# Altium project microphone_array.PrjPcb
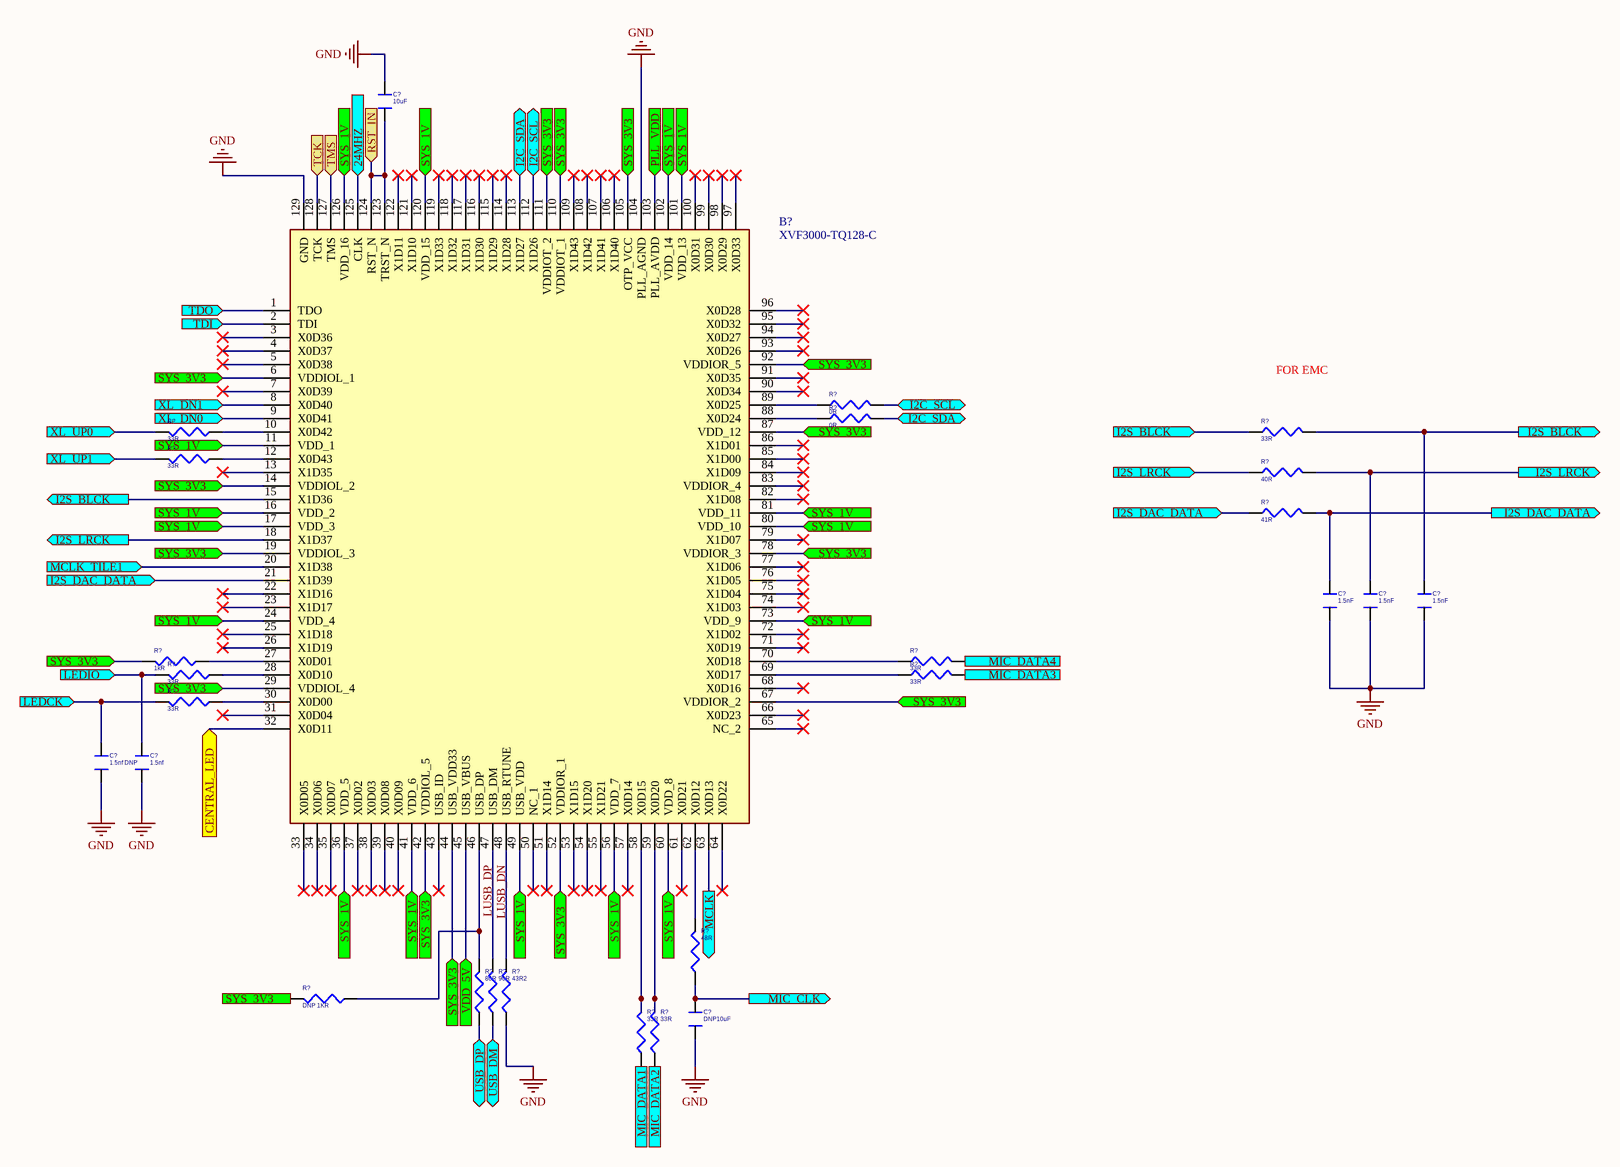
[diagram p0: XVF3000.SchDoc]
7 sheets, 228 parts. Net scope: flat (ports and power ports of the same name join across sheets).
Sheets:
  XVF3000.SchDoc
  WM8960.SchDoc
  Power_interconnect.SchDoc
  Microphone.SchDoc
  led.SchDoc
  Sys_Clock.SchDoc
  X_core_Powerful_pull_up.SchDoc

## Sheet XVF3000.SchDoc
size A3; SheetNumber: 1; SheetTotal: 7

### Parts
(Parts that share a designator on the sheet are numbered #1, #2 ... from top to bottom, then left to right.)
B?#1  XVF3000-TQ128-C  [QFP40P1600X1600X120-129N]
C?#1  10uF  [C0603]
C?#2  1.5nF  [C0603]
C?#3  1.5nF  [C0603]
C?#4  1.5nF  [C0603]
C?#5  1.5nf DNP  [C0603]
C?#6  1.5nf  [C0603]
C?#7  DNP10uF  [C0603]
R?#1  33R  [R 0603]
R?#2  0R  [R 0603]
R?#3  0R  [R 0603]
R?#4  33R  [R 0603]
R?#5  33R  [R 0603]
R?#6  40R  [R 0603]
R?#7  41R  [R 0603]
R?#8  1kR  [R 0603]
R?#9  33R  [R 0603]
R?#10  33R  [R 0603]
R?#11  33R  [R 0603]
R?#12  33R  [R 0603]
R?#13  48R  [R 0603]
R?#14  DNP 1KR  [R 0603]
R?#15  80R  [R 0603]
R?#16  90R  [R 0603]
R?#17  43R2  [R 0603]
R?#18  33R  [R 0603]
R?#19  33R  [R 0603]

### Ports
24MHZ (in), _I2S_BLCK (out), _I2S_DAC_DATA (out), _I2S_LRCK (out), CENTRAL_LED (in), I2C_SCL (bidir), I2C_SDA (bidir), I2S_BLCK (in), I2S_BLCK (out), I2S_DAC_DATA (in), I2S_LRCK (in), I2S_LRCK (out), LEDCK (in), LEDIO (in), MCLK (out), MCLK_TILE1 (in), MIC_CLK (out), MIC_DATA1 (in), MIC_DATA2 (in), MIC_DATA3 (in), MIC_DATA4 (in), PLL_VDD (in), RST_IN (in), SYS_1V (in), SYS_3V3 (in), TCK (in), TDI (in), TDO (in), TMS (in), USB_DM (bidir), USB_DP (bidir), VDD_5V (in), XL_DN0 (in), XL_DN1 (in), XL_UP0 (in), XL_UP1 (in)

### Nets
GND: B?#1.104(PLL_AGND) B?#1.129(GND) C?#1.2 C?#2.1 C?#3.1 C?#4.1 C?#5.1 C?#6.1 C?#7.1 R?#17.1
LUSB_DN: B?#1.47(USB_DM) R?#16.2
LUSB_DP: B?#1.46(USB_DP) R?#14.1 R?#15.2
NetB?#1_1: B?#1.1(TDO) ; port TDO
NetB?#1_2: B?#1.2(TDI) ; port TDI
NetB?#1_6: B?#1.6(VDDIOL_1) B?#1.14(VDDIOL_2) B?#1.19(VDDIOL_3) B?#1.29(VDDIOL_4) B?#1.42(VDDIOL_5) B?#1.44(USB_VDD33) B?#1.52(VDDIOR_1) B?#1.67(VDDIOR_2) B?#1.78(VDDIOR_3) B?#1.87(VDD_12) B?#1.92(VDDIOR_5) B?#1.105(OTP_VCC) B?#1.110(VDDIOT_1) B?#1.111(VDDIOT_2) R?#8.2 R?#14.2 ; port SYS_3V3
NetB?#1_8: B?#1.8(X0D40) ; port XL_DN1
NetB?#1_9: B?#1.9(X0D41) ; port XL_DN0
NetB?#1_10: B?#1.10(X0D42) R?#1.1
NetB?#1_11: B?#1.11(VDD_1) B?#1.16(VDD_2) B?#1.17(VDD_3) B?#1.24(VDD_4) B?#1.36(VDD_5) B?#1.41(VDD_6) B?#1.49(USB_VDD) B?#1.56(VDD_7) B?#1.60(VDD_8) B?#1.73(VDD_9) B?#1.80(VDD_10) B?#1.81(VDD_11) B?#1.101(VDD_13) B?#1.102(VDD_14) B?#1.120(VDD_15) B?#1.126(VDD_16) ; port SYS_1V
NetB?#1_12: B?#1.12(X0D43) R?#4.1
NetB?#1_15: B?#1.15(X1D36) R?#5.1 ; port I2S_BLCK
NetB?#1_18: B?#1.18(X1D37) R?#6.1 ; port I2S_LRCK
NetB?#1_20: B?#1.20(X1D38) ; port MCLK_TILE1
NetB?#1_21: B?#1.21(X1D39) R?#7.1 ; port I2S_DAC_DATA
NetB?#1_27: B?#1.27(X0D01) R?#8.1
NetB?#1_28: B?#1.28(X0D10) R?#9.1
NetB?#1_30: B?#1.30(X0D00) R?#11.1
NetB?#1_32: B?#1.32(X0D11) ; port CENTRAL_LED
NetB?#1_45: B?#1.45(USB_VBUS) ; port VDD_5V
NetB?#1_48: B?#1.48(USB_RTUNE) R?#17.2
NetB?#1_58: B?#1.58(X0D15) R?#18.2
NetB?#1_59: B?#1.59(X0D20) R?#19.2
NetB?#1_62: B?#1.62(X0D12) R?#13.2
NetB?#1_63: B?#1.63(X0D13) ; port MCLK
NetB?#1_69: B?#1.69(X0D17) R?#12.1
NetB?#1_70: B?#1.70(X0D18) R?#10.1
NetB?#1_88: B?#1.88(X0D24) R?#3.1
NetB?#1_89: B?#1.89(X0D25) R?#2.1
NetB?#1_103: B?#1.103(PLL_AVDD) ; port PLL_VDD
NetB?#1_112: B?#1.112(X1D26) R?#2.2 ; port I2C_SCL
NetB?#1_113: B?#1.113(X1D27) R?#3.2 ; port I2C_SDA
NetB?#1_123: B?#1.123(TRST_N) B?#1.124(RST_N) C?#1.1 ; port RST_IN
NetB?#1_125: B?#1.125(CLK) ; port 24MHZ
NetB?#1_127: B?#1.127(TMS) ; port TMS
NetB?#1_128: B?#1.128(TCK) ; port TCK
NetB?#3_12: C?#4.2 R?#5.2 ; port _I2S_BLCK
NetB?#3_13: C?#3.2 R?#6.2 ; port _I2S_LRCK
NetB?#3_14: C?#2.2 R?#7.2 ; port _I2S_DAC_DATA
NetB?#6_2: C?#6.2 R?#9.2 ; port LEDIO
NetB?#7_2: C?#5.2 R?#11.2 ; port LEDCK
NetB?#8_1: C?#7.2 R?#13.1 ; port MIC_CLK
NetJ?#2_15: R?#15.1 ; port USB_DP
NetJ?#2_16: R?#16.1 ; port USB_DM
NetMK?#1_4: R?#19.1 ; port MIC_DATA2
NetMK?#2_4: R?#10.2 ; port MIC_DATA4
NetMK?#3_4: R?#12.2 ; port MIC_DATA3
NetMK_4: R?#18.1 ; port MIC_DATA1
NetR?#1_2: R?#1.2 ; port XL_UP0
NetR?#4_2: R?#4.2 ; port XL_UP1

Not connected (* = marked no-connect by the designer): B?#1 3(X0D36)* 4(X0D37)* 5(X0D38)* 7(X0D39)* 13(X1D35)* 22(X1D16)* 23(X1D17)* 25(X1D18)* 26(X1D19)* 31(X0D04)* 33(X0D05)* 34(X0D06)* 35(X0D07)* 37(X0D02)* 38(X0D03)* 39(X0D08)* 40(X0D09)* 43(USB_ID)* 50(NC_1)* 51(X1D14)* 53(X1D15)* 54(X1D20)* 55(X1D21)* 57(X0D14)* 61(X0D21)* 64(X0D22)* 65(NC_2)* 66(X0D23)* 68(X0D16)* 71(X0D19)* 72(X1D02)* 74(X1D03)* 75(X1D04)* 76(X1D05)* 77(X1D06)* 79(X1D07)* 82(X1D08)* 83(VDDIOR_4)* 84(X1D09)* 85(X1D00)* 86(X1D01)* 90(X0D34)* 91(X0D35)* 93(X0D26)* 94(X0D27)* 95(X0D32)* 96(X0D28)* 97(X0D33)* 98(X0D29)* 99(X0D30)* 100(X0D31)* 106(X1D40)* 107(X1D41)* 108(X1D42)* 109(X1D43)* 114(X1D28)* 115(X1D29)* 116(X1D30)* 117(X1D31)* 118(X1D32)* 119(X1D33)* 121(X1D10)* 122(X1D11)*

### Notes on the sheet
- FOR EMC

### Library data of the parts
B?#1 = XVF3000-TQ128-C: IC PROC 32BIT VOICE XCORE TQ128; Manufacturer_Name: XMOS; Geometry.Height: 1.2mm; Manufacturer_Part_Number: XVF3000-TQ128-C; Mouser Part Number: *; Mouser Price/Stock: *; Arrow Part Number: *; Arrow Price/Stock: *; Datasheet Link: https://datasheet.datasheetarchive.com/originals/distributors/DKDS-37/730530.pdf
C?#1-C?#7 = CAPACITOR_0_Dup5_3: CAP ±20%/10V/X5R/SMT0603; PAGE: 2
R?#1-R?#19 = R_Dup1: RES 1/16W 5% SMT0402

## Sheet WM8960.SchDoc
size A3; SheetNumber: 2; SheetTotal: 6
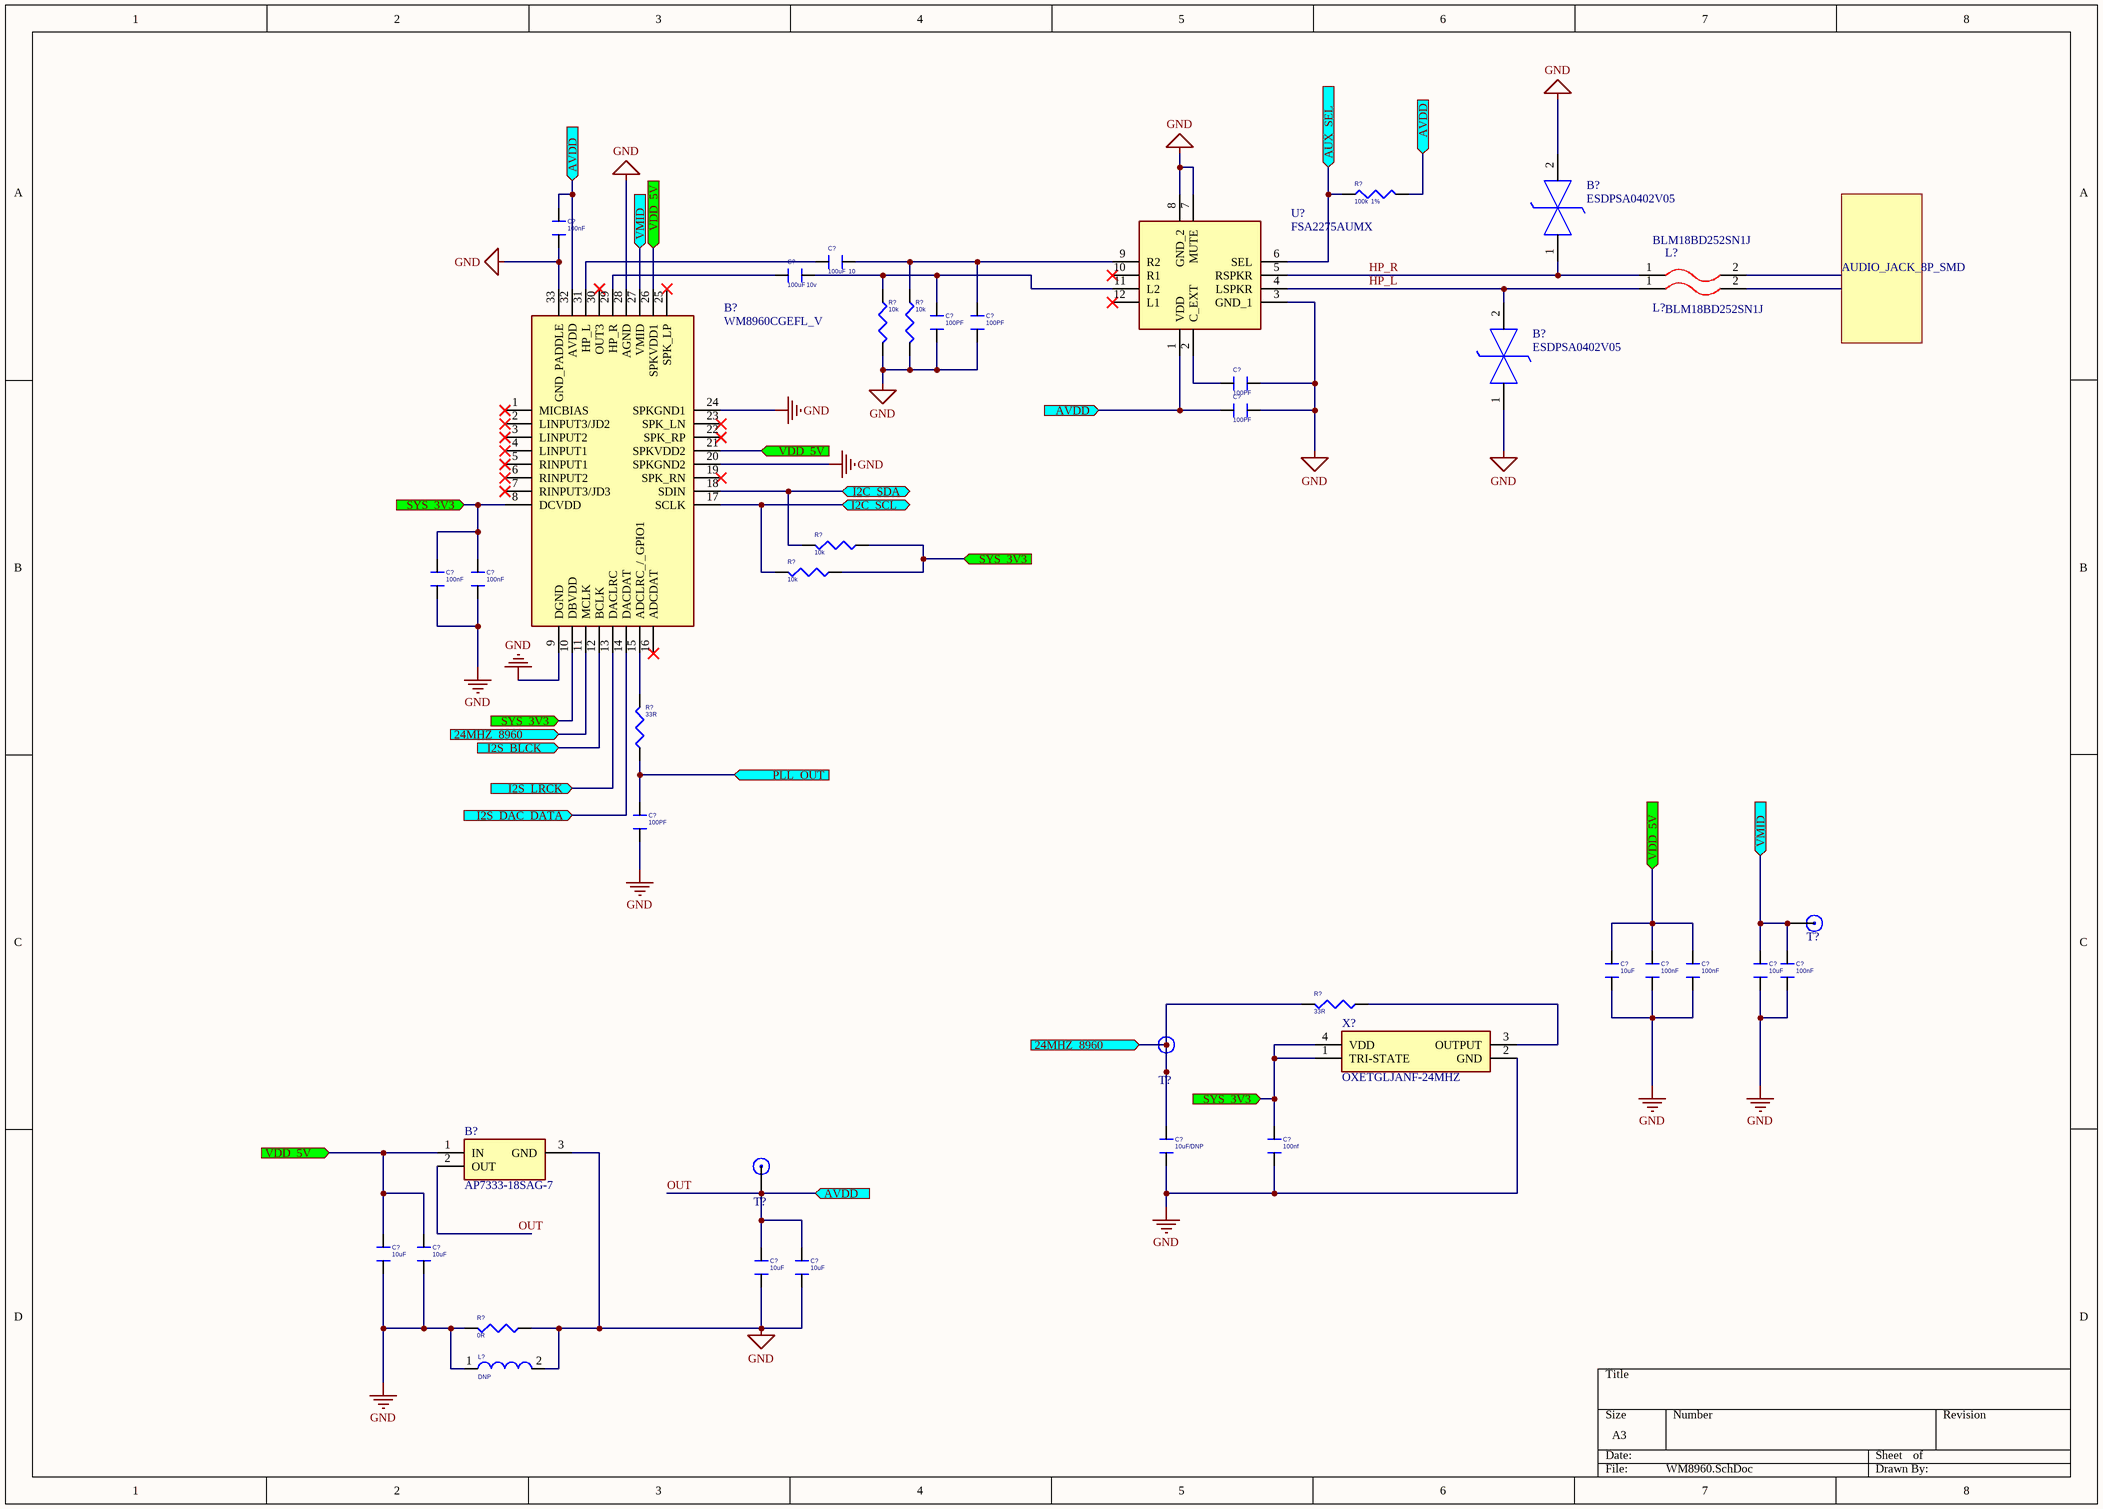
[diagram p1: WM8960.SchDoc]

### Parts
(Parts that share a designator on the sheet are numbered #1, #2 ... from top to bottom, then left to right.)
B?#2  ESDPSA0402V05  [ESDPSA0402V05]
B?#3  WM8960CGEFL_V  [QFN50P500X500X100-33N]
B?#4  ESDPSA0402V05  [ESDPSA0402V05]
B?#5  AP7333-18SAG-7  [SOT96P240X135-3N]
C?#8  100nF  [C0603]
C?#9  100uF  10  [C0603]
C?#10  100uF 10v  [C0603]
C?#11  100PF  [C0603]
C?#12  100PF  [C0603]
C?#13  100PF  [C0603]
C?#14  100PF  [C0603]
C?#15  100nF  [C0603]
C?#16  100nF  [C0603]
C?#17  100PF  [C0603]
C?#18  10uF  [C0603]
C?#19  100nF  [C0603]
C?#20  100nF  [C0603]
C?#21  10uF  [C0603]
C?#22  100nF  [C0603]
C?#23  10uF/DNP  [C0603]
C?#24  100nf  [C0603]
C?#25  10uF  [C0603]
C?#26  10uF  [C0603]
C?#27  10uF  [C0603]
C?#28  10uF  [C0603]
L?#1  BLM18BD252SN1J  [BLM18EG121SH1D]
L?#2  BLM18BD252SN1J  [BLM18EG121SH1D]
L?#3  DNP  [CD35]
R?#20  100k  1%  [R 0603]
R?#21  10k  [R 0603]
R?#22  10k  [R 0603]
R?#23  10k  [R 0603]
R?#24  10k  [R 0603]
R?#25  33R  [R 0603]
R?#26  33R  [R 0603]
R?#27  0R  [R 0603]
T?#1  Test_point  [Test_point]  (value not drawn)
T?#2  Test_point  [Test_point]  (value not drawn)
T?#3  Test_point  [Test_point]  (value not drawn)
U?#1  FSA2275AUMX  [FSA2275AUMX]
X?#1  OXETGLJANF-24MHZ  [OXETGLJANF24MHZ]

### Ports
24MHZ_8960 (in), _I2S_BLCK (in), _I2S_DAC_DATA (in), _I2S_LRCK (in), AUX_SEL (in), AVDD (in), I2C_SCL (bidir), I2C_SDA (bidir), PLL_OUT (in), SYS_3V3 (in), VDD_5V (in), VMID (in)

### Nets
GND: B?#2.2(K2) B?#3.9(DGND) B?#3.20(SPKGND2) B?#3.24(SPKGND1) B?#3.28(AGND) B?#3.33(GND_PADDLE) B?#4.1(K1) B?#5.3(GND) C?#8.1 C?#11.1 C?#12.1 C?#13.1 C?#14.1 C?#15.1 C?#16.1 C?#17.1 C?#18.1 C?#19.1 C?#20.1 C?#21.1 C?#22.1 C?#23.1 C?#24.1 C?#25.1 C?#26.1 C?#27.1 C?#28.1 L?#3.1 L?#3.2 R?#21.2 R?#22.2 R?#27.1 R?#27.2 U?#1.3(GND_1) U?#1.7(MUTE) U?#1.8(GND_2) X?#1.2(GND)
HP_L: B?#4.2(K2) L?#2.1 U?#1.4(LSPKR)
HP_R: B?#2.1(K1) L?#1.1 U?#1.5(RSPKR)
OUT: B?#3.32(AVDD) B?#5.2(OUT) C?#8.2 C?#14.2 C?#27.2 C?#28.2 R?#20.2 T?#3.1 U?#1.1(VDD) ; port AVDD
NetB?#1_6: B?#3.8(DCVDD) B?#3.10(DBVDD) C?#15.2 C?#16.2 C?#24.2 R?#23.1 R?#24.1 X?#1.1(TRI-STATE) X?#1.4(VDD) ; port SYS_3V3
NetB?#1_45: B?#3.21(SPKVDD2) B?#3.26(SPKVDD1) B?#5.1(IN) C?#18.2 C?#19.2 C?#20.2 C?#25.2 C?#26.2 ; port VDD_5V
NetB?#1_112: B?#3.17(SCLK) R?#24.2 ; port I2C_SCL
NetB?#1_113: B?#3.18(SDIN) R?#23.2 ; port I2C_SDA
NetB?#3_11: B?#3.11(MCLK) C?#23.2 R?#26.2 T?#2.1 ; port 24MHZ_8960
NetB?#3_12: B?#3.12(BCLK) ; port _I2S_BLCK
NetB?#3_13: B?#3.13(DACLRC) ; port _I2S_LRCK
NetB?#3_14: B?#3.14(DACDAT) ; port _I2S_DAC_DATA
NetB?#3_15: B?#3.15(ADCLRC_/_GPIO1) R?#25.2
NetB?#3_27: B?#3.27(VMID) C?#21.2 C?#22.2 T?#1.1 ; port VMID
NetB?#3_29: B?#3.29(HP_R) C?#10.2
NetB?#3_31: B?#3.31(HP_L) C?#9.2
NetC?#9_1: C?#9.1 C?#12.2 R?#22.1 U?#1.9(R2)
NetC?#10_1: C?#10.1 C?#11.2 R?#21.1 U?#1.11(L2)
NetC?#13_2: C?#13.2 U?#1.2(C_EXT)
NetC?#17_2: C?#17.2 R?#25.1 ; port PLL_OUT
NetJ?#1_1: R?#20.1 U?#1.6(SEL) ; port AUX_SEL
NetR?#26_1: R?#26.1 X?#1.3(OUTPUT)

Not connected (* = marked no-connect by the designer): B?#3 1(MICBIAS)* 2(LINPUT3/JD2)* 3(LINPUT2)* 4(LINPUT1)* 5(RINPUT1)* 6(RINPUT2)* 7(RINPUT3/JD3)* 16(ADCDAT)* 19(SPK_RN)* 22(SPK_RP)* 23(SPK_LN)* 25(SPK_LP)* 30(OUT3)*; L?#1 2; L?#2 2; U?#1 10(R1)* 12(L1)*

### Notes on the sheet
- AUDIO_JACK_8P_SMD

### Library data of the parts
B?#2 B?#4 = ESDPSA0402V05: Polymer ESD Suppressor; Manufacturer_Name: Good-Ark; Geometry.Height: 0.45mm; Manufacturer_Part_Number: ESDPSA0402V05; Mouser Part Number: *; Mouser Price/Stock: *; Arrow Part Number: *; Arrow Price/Stock: *; Datasheet Link: https://4donline.ihs.com/images/VipMasterIC/IC/GOAE/GOAE-S-A0000149384/GOAE-S-A0000149384-1.pdf?hkey=EF798316E3902B6ED9A73243A3159BB0
B?#3 = WM8960CGEFL_V: Interface - CODECs Stereo CODEC with 1W DRIVER; Manufacturer_Name: Cirrus Logic; Manufacturer_Part_Number: WM8960CGEFL/V; Geometry.Height: 1mm; Mouser Part Number: 238-WM8960CGEFL/V; Mouser Price/Stock: https://www.mouser.co.uk/ProductDetail/Cirrus-Logic/WM8960CGEFL-V?qs=G8wrXCBxhFteielmzwPrEw%3D%3D; Arrow Part Number: *; Arrow Price/Stock: *; Datasheet Link: https://componentsearchengine.com/Datasheets/1/WM8960CGEFL_V.pdf
B?#5 = AP7333-18SAG-7: Diodes Inc AP7333-18SAG-7, Single Linear Voltage Regulator, 300mA 1.8 V, +/-2%, 3-Pin SOT-23; Manufacturer_Name: Diodes Inc.; Geometry.Height: 1.35mm; Manufacturer_Part_Number: AP7333-18SAG-7; Mouser Part Number: 621-AP7333-18SAG-7; Mouser Price/Stock: https://www.mouser.co.uk/ProductDetail/Diodes-Incorporated/AP7333-18SAG-7?qs=vIZ3oKQCLxpEALu0NaomtQ%3D%3D; Arrow Part Number: AP7333-18SAG-7; Arrow Price/Stock: https://www.arrow.com/en/products/ap7333-18sag-7/diodes-incorporated?region=nac; Datasheet Link: https://www.diodes.com/assets/Datasheets/AP7333.pdf
C?#8-C?#28 = CAPACITOR_0_Dup3: CAP ±20%/10V/X5R/SMT0603; PAGE: 1
L?#1 L?#2 = BLM18BD252SN1J: BLM18_N1J Series EMI Suppression Filter 2500+/-25% at 100MHz 150mA @85; Manufacturer_Name: Murata Electronics; Geometry.Height: 0.95mm; Manufacturer_Part_Number: BLM18BD252SN1J; Mouser Part Number: *; Mouser Price/Stock: *; Arrow Part Number: *; Arrow Price/Stock: *; Datasheet Link: http://www.murata.com/~/media/webrenewal/support/library/catalog/products/emc/emifil/c31e.ashx?la=en-gb
L?#3 = INDUCTOR_1: Inductor 2000MA 4.0X4.0X2.0
R?#20-R?#27 = R_Dup1: RES 1/16W 5% SMT0402
U?#1 = FSA2275AUMX: ON Semiconductor FSA2275AUMX, Audio Switch IC DPDT, 3.3 V dc, 12-Pin UMLP; Manufacturer_Name: onsemi; Geometry.Height: 0.6mm; Manufacturer_Part_Number: FSA2275AUMX; Mouser Part Number: 512-FSA2275AUMX; Mouser Price/Stock: https://www.mouser.co.uk/ProductDetail/ON-Semiconductor-Fairchild/FSA2275AUMX?qs=Mv7BduZupUhxHdQdUdEuNg%3D%3D; Arrow Part Number: FSA2275AUMX; Arrow Price/Stock: https://www.arrow.com/en/products/fsa2275aumx/on-semiconductor; Datasheet Link: https://www.onsemi.com/pub/Collateral/FSA2275A-D.pdf
X?#1 = OXETGLJANF-24MHZ: 3.3V~3.3V -40~+85 15mA +/-50ppm 24MHz SMD3225-4P Oscillators ROHS; Manufacturer_Name: TAITIEN; Geometry.Height: 1.1mm; Manufacturer_Part_Number: OXETGLJANF-24MHZ; Mouser Part Number: *; Mouser Price/Stock: *; Arrow Part Number: *; Arrow Price/Stock: *; Datasheet Link: https://datasheet.lcsc.com/lcsc/1811052217_TAITIEN-Elec-OXETGLJANF-24MHZ_C295524.pdf

## Sheet Power_interconnect.SchDoc
size A3; SheetNumber: 3; SheetTotal: 6
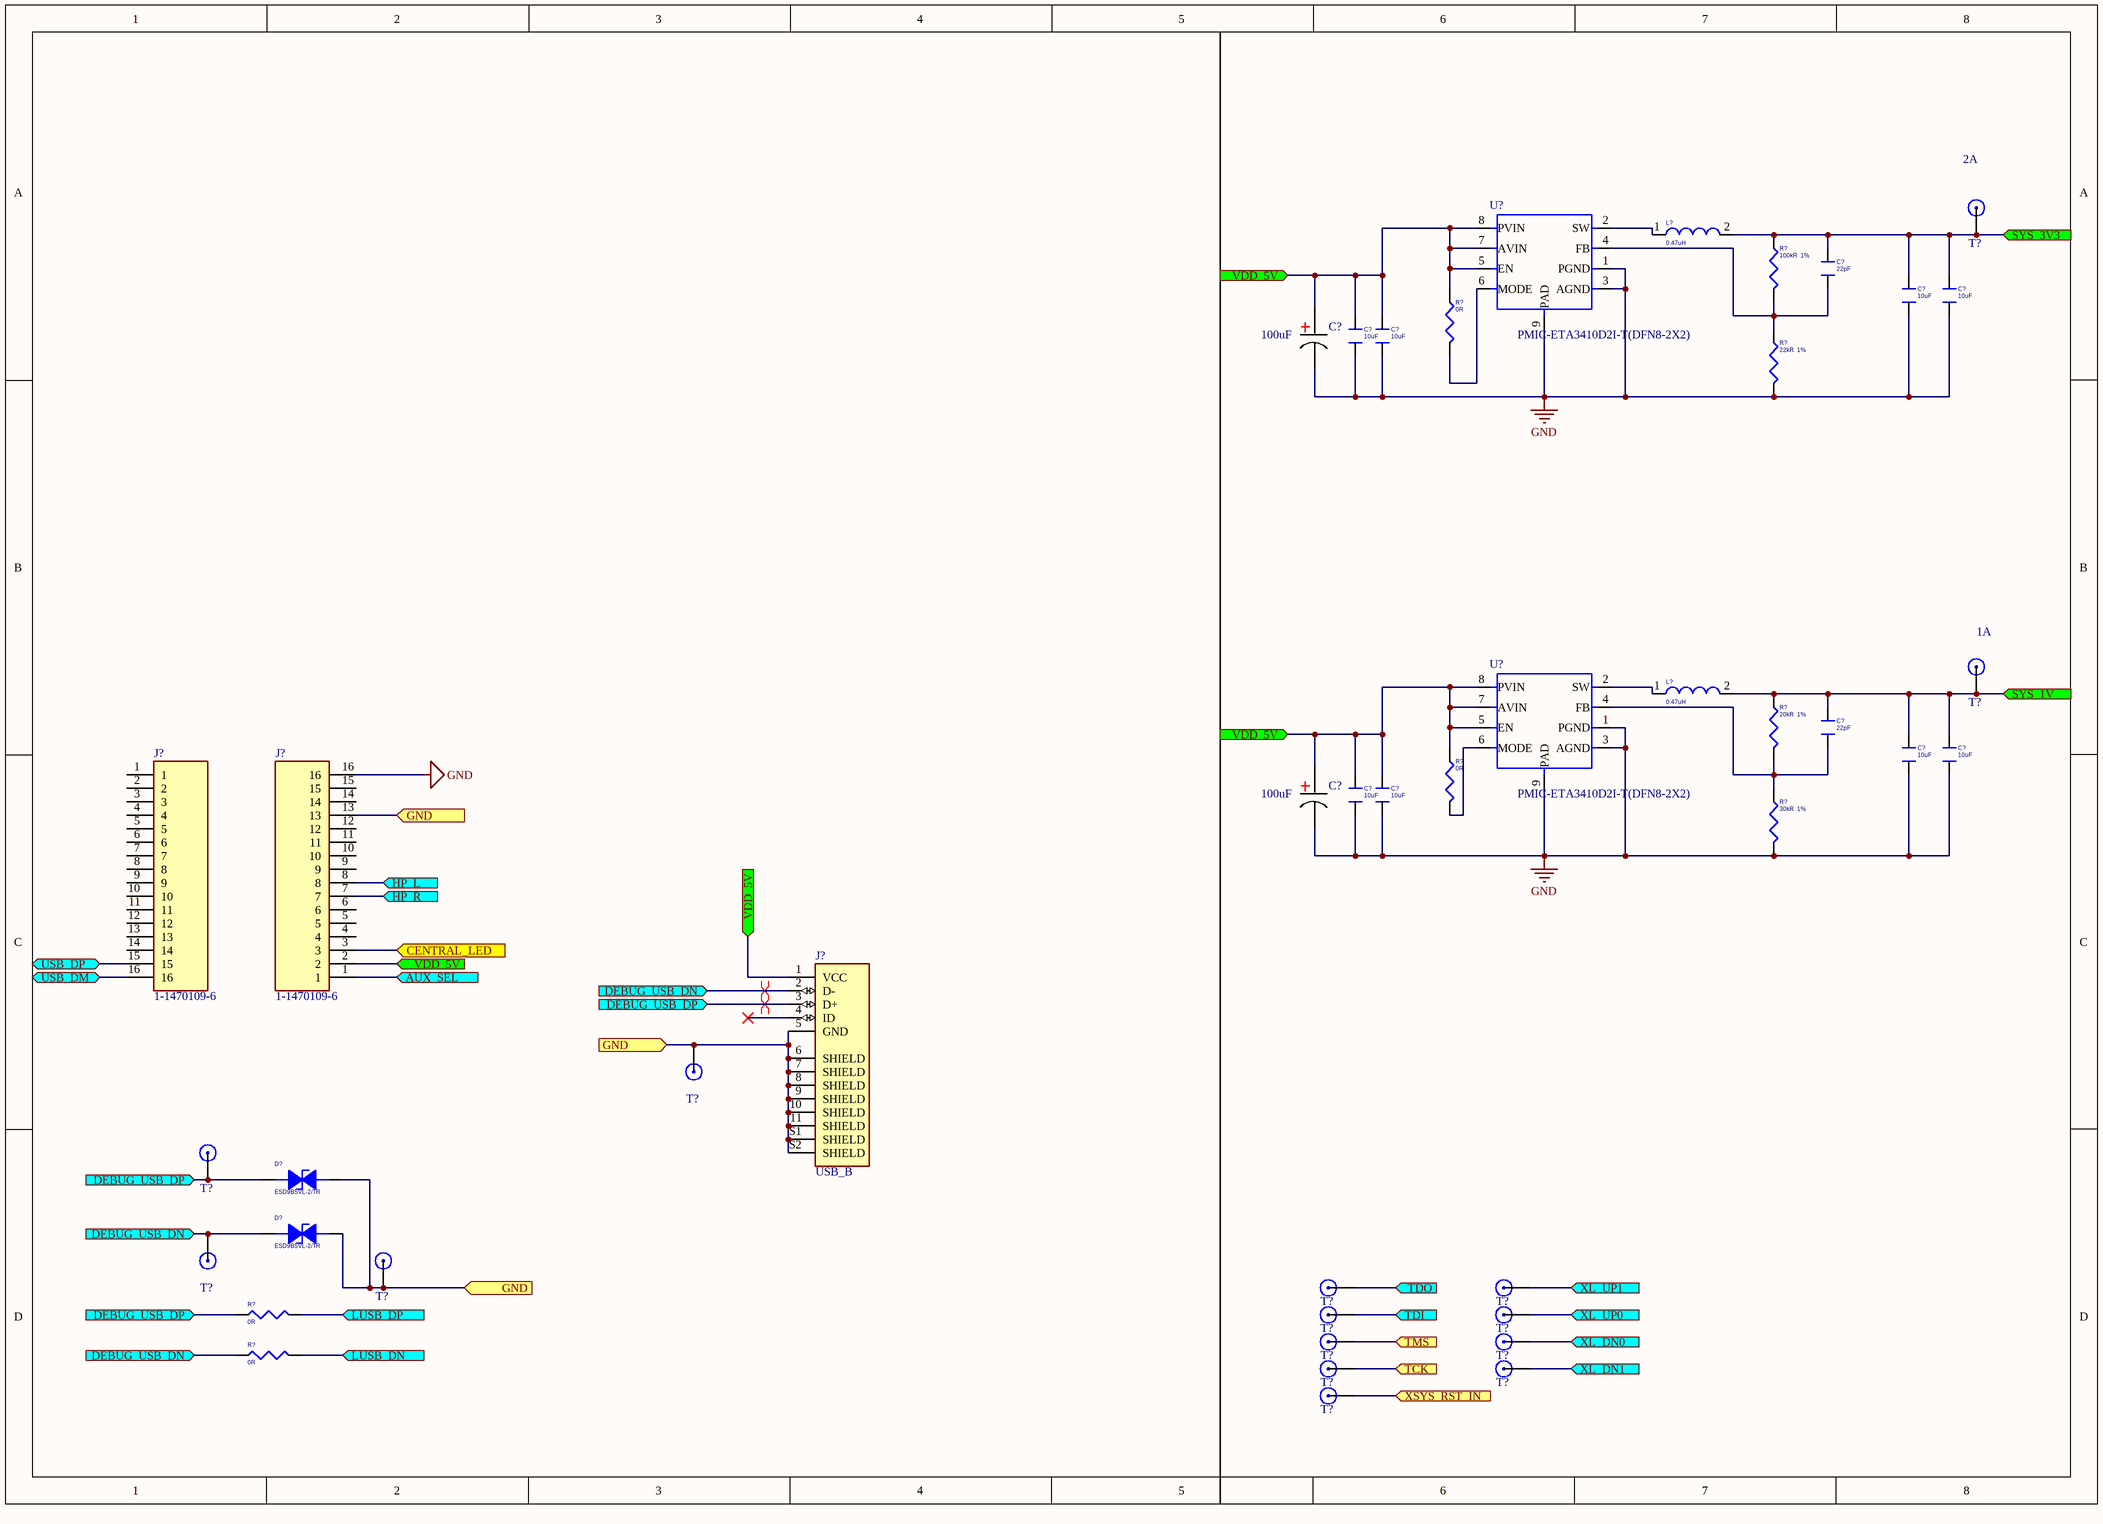
[diagram p2: Power_interconnect.SchDoc]

### Parts
(Parts that share a designator on the sheet are numbered #1, #2 ... from top to bottom, then left to right.)
C?#29  22pF  [C0603]
C?#30  10uF  [C0603]
C?#31  10uF  [C0603]
C?#32  10uF  [C0603]
C?#33  10uF  [C0603]
C?#34  100uF  [E_Capacitor]
C?#35  22pF  [C0603]
C?#36  10uF  [C0603]
C?#37  10uF  [C0603]
C?#38  10uF  [C0603]
C?#39  10uF  [C0603]
C?#40  100uF  [E_Capacitor]
D?#1  ESD9B5VL-2/TR  [ESD0402]
D?#2  ESD9B5VL-2/TR  [ESD0402]
J?#1  1-1470109-6  [TE_1-1470109-6]
J?#2  1-1470109-6  [TE_1-1470109-6]
J?#3  USB_B  [AMPHENOL_10103594-0001LF]
L?#4  0.47uH  [CD35]
L?#5  0.47uH  [CD35]
R?#28  100kR  1%  [R0402]
R?#29  0R  [R0402]
R?#30  22kR  1%  [R0402]
R?#31  20kR  1%  [R0402]
R?#32  0R  [R0402]
R?#33  30kR  1%  [R0402]
R?#34  0R  [R0402]
R?#35  0R  [R0402]
T?#4  Test_point  [Test_point]  (value not drawn)
T?#5  Test_point  [Test_point]  (value not drawn)
T?#6  Test_point  [Test_point]  (value not drawn)
T?#7  Test_point  [Test_point]  (value not drawn)
T?#8  Test_point  [Test_point]  (value not drawn)
T?#9  Test_point  [Test_point]  (value not drawn)
T?#10  Test_point  [Test_point]  (value not drawn)
T?#11  Test_point  [Test_point]  (value not drawn)
T?#12  Test_point  [Test_point]  (value not drawn)
T?#13  Test_point  [Test_point]  (value not drawn)
T?#14  Test_point  [Test_point]  (value not drawn)
T?#15  Test_point  [Test_point]  (value not drawn)
T?#16  Test_point  [Test_point]  (value not drawn)
T?#17  Test_point  [Test_point]  (value not drawn)
T?#18  Test_point  [Test_point]  (value not drawn)
U?#2  PMIC-ETA3410D2I-T(DFN8-2X2)  [ETA3410]
U?#3  PMIC-ETA3410D2I-T(DFN8-2X2)  [ETA3410]

### Ports
AUX_SEL (in), CENTRAL_LED (in), DEBUG_USB_DN (in), DEBUG_USB_DP (in), GND (in), HP_L (in), HP_R (in), LUSB_DN (in), LUSB_DP (in), SYS_1V (in), SYS_3V3 (in), TCK (in), TDI (in), TDO (in), TMS (in), USB_DM (bidir), USB_DP (bidir), VDD_5V (in), XL_DN0 (in), XL_DN1 (in), XL_UP0 (in), XL_UP1 (in), XSYS_RST_IN (in)

### Nets
GND: C?#30.1 C?#31.1 C?#32.1 C?#33.1 C?#34.1 C?#36.1 C?#37.1 C?#38.1 C?#39.1 C?#40.1 J?#1.16 R?#30.2 R?#33.2 U?#2.1(PGND) U?#2.3(AGND) U?#2.9(PAD) U?#3.1(PGND) U?#3.3(AGND) U?#3.9(PAD)
NetB?#1_1: T?#10.1 ; port TDO
NetB?#1_2: T?#12.1 ; port TDI
NetB?#1_6: C?#29.2 C?#30.2 C?#31.2 L?#4.2 R?#28.1 T?#4.1 ; port SYS_3V3
NetB?#1_8: T?#17.1 ; port XL_DN1
NetB?#1_9: T?#15.1 ; port XL_DN0
NetB?#1_11: C?#35.2 C?#36.2 C?#37.2 L?#5.2 R?#31.1 T?#5.1 ; port SYS_1V
NetB?#1_32: J?#1.3 ; port CENTRAL_LED
NetB?#1_45: C?#32.2 C?#33.2 C?#34.2 C?#38.2 C?#39.2 C?#40.2 J?#1.2 J?#3.1(VCC) R?#29.1 R?#32.1 U?#2.5(EN) U?#2.7(AVIN) U?#2.8(PVIN) U?#3.5(EN) U?#3.7(AVIN) U?#3.8(PVIN) ; port VDD_5V
NetB?#1_127: T?#14.1 ; port TMS
NetB?#1_128: T?#16.1 ; port TCK
NetC?#29_1: C?#29.1 R?#28.2 R?#30.1 U?#2.4(FB)
NetC?#35_1: C?#35.1 R?#31.2 R?#33.1 U?#3.4(FB)
NetD?#1_1: D?#1.1(ANODE) J?#3.3(D+) R?#34.1 T?#7.1 ; port DEBUG_USB_DP
NetD?#1_2: D?#1.2(CATHODE) D?#2.2(CATHODE) J?#1.13 J?#3.5(GND) J?#3.6(SHIELD) J?#3.7(SHIELD) J?#3.8(SHIELD) J?#3.9(SHIELD) J?#3.10(SHIELD) J?#3.11(SHIELD) J?#3.S1(SHIELD) J?#3.S2(SHIELD) T?#6.1 T?#9.1 ; port GND
NetD?#2_1: D?#2.1(ANODE) J?#3.2(D-) R?#35.1 T?#8.1 ; port DEBUG_USB_DN
NetJ?#1_1: J?#1.1 ; port AUX_SEL
NetJ?#1_7: J?#1.7 ; port HP_R
NetJ?#1_8: J?#1.8 ; port HP_L
NetJ?#2_15: J?#2.15 ; port USB_DP
NetJ?#2_16: J?#2.16 ; port USB_DM
NetL?#4_1: L?#4.1 U?#2.2(SW)
NetL?#5_1: L?#5.1 U?#3.2(SW)
NetR?#1_2: T?#13.1 ; port XL_UP0
NetR?#4_2: T?#11.1 ; port XL_UP1
NetR?#29_2: R?#29.2 U?#2.6(MODE)
NetR?#32_2: R?#32.2 U?#3.6(MODE)
NetR?#34_2: R?#34.2 ; port LUSB_DP
NetR?#35_2: R?#35.2 ; port LUSB_DN
NetT?#18_1: T?#18.1 ; port XSYS_RST_IN

Not connected (* = marked no-connect by the designer): J?#1 4 5 6 9 10 11 12 14 15; J?#2 1 2 3 4 5 6 7 8 9 10 11 12 13 14; J?#3 4(ID)*

### Layout directives
differential pair: NetD?#1_1, NetD?#2_1

### Notes on the sheet
- (near T?#4) 2A
- (near T?#5) 1A

### Library data of the parts
C?#29-C?#33 C?#35-C?#39 = CAP_0603: CAP ±20%/10V/X5R/SMT0603
C?#34 = E_Capacitor
C?#40 = E_Capacitor: 10v
D?#1 D?#2 = 1_1.5KE100A_1: ESD9B5V Bidirection ESD Protection; 1ST PART DESCRIPTION: WILL ESD9B5V Bidirection ESD Protection
J?#3 = USB_B: USB - micro B USB 2.0 Receptacle Connector 5 Position Surface Mount, Right Angle; Through Hole; MP: 10103594-0001LF; Value: *; Package: None; Availability: Unavailable; Price: None
L?#4 L?#5 = INDUCTOR: Inductor 1150MA 4.0X4.0X2.0
R?#28-R?#35 = R_0603: RES 1/8W 5% SMT0603
U?#2 U?#3 = PMIC-ETA3410D2I-T(DFN8-2X2): 310030161; Package: None; Price: None; Value: *; MP: ETA3410D2I-T; Availability: Unavailable
J?#1 J?#2 = 1-1470109-6: Package: None; Price: None; Value: *; MP: 1-1470109-6; Availability: Unavailable

## Sheet Microphone.SchDoc
size A3; SheetNumber: 4; SheetTotal: 7
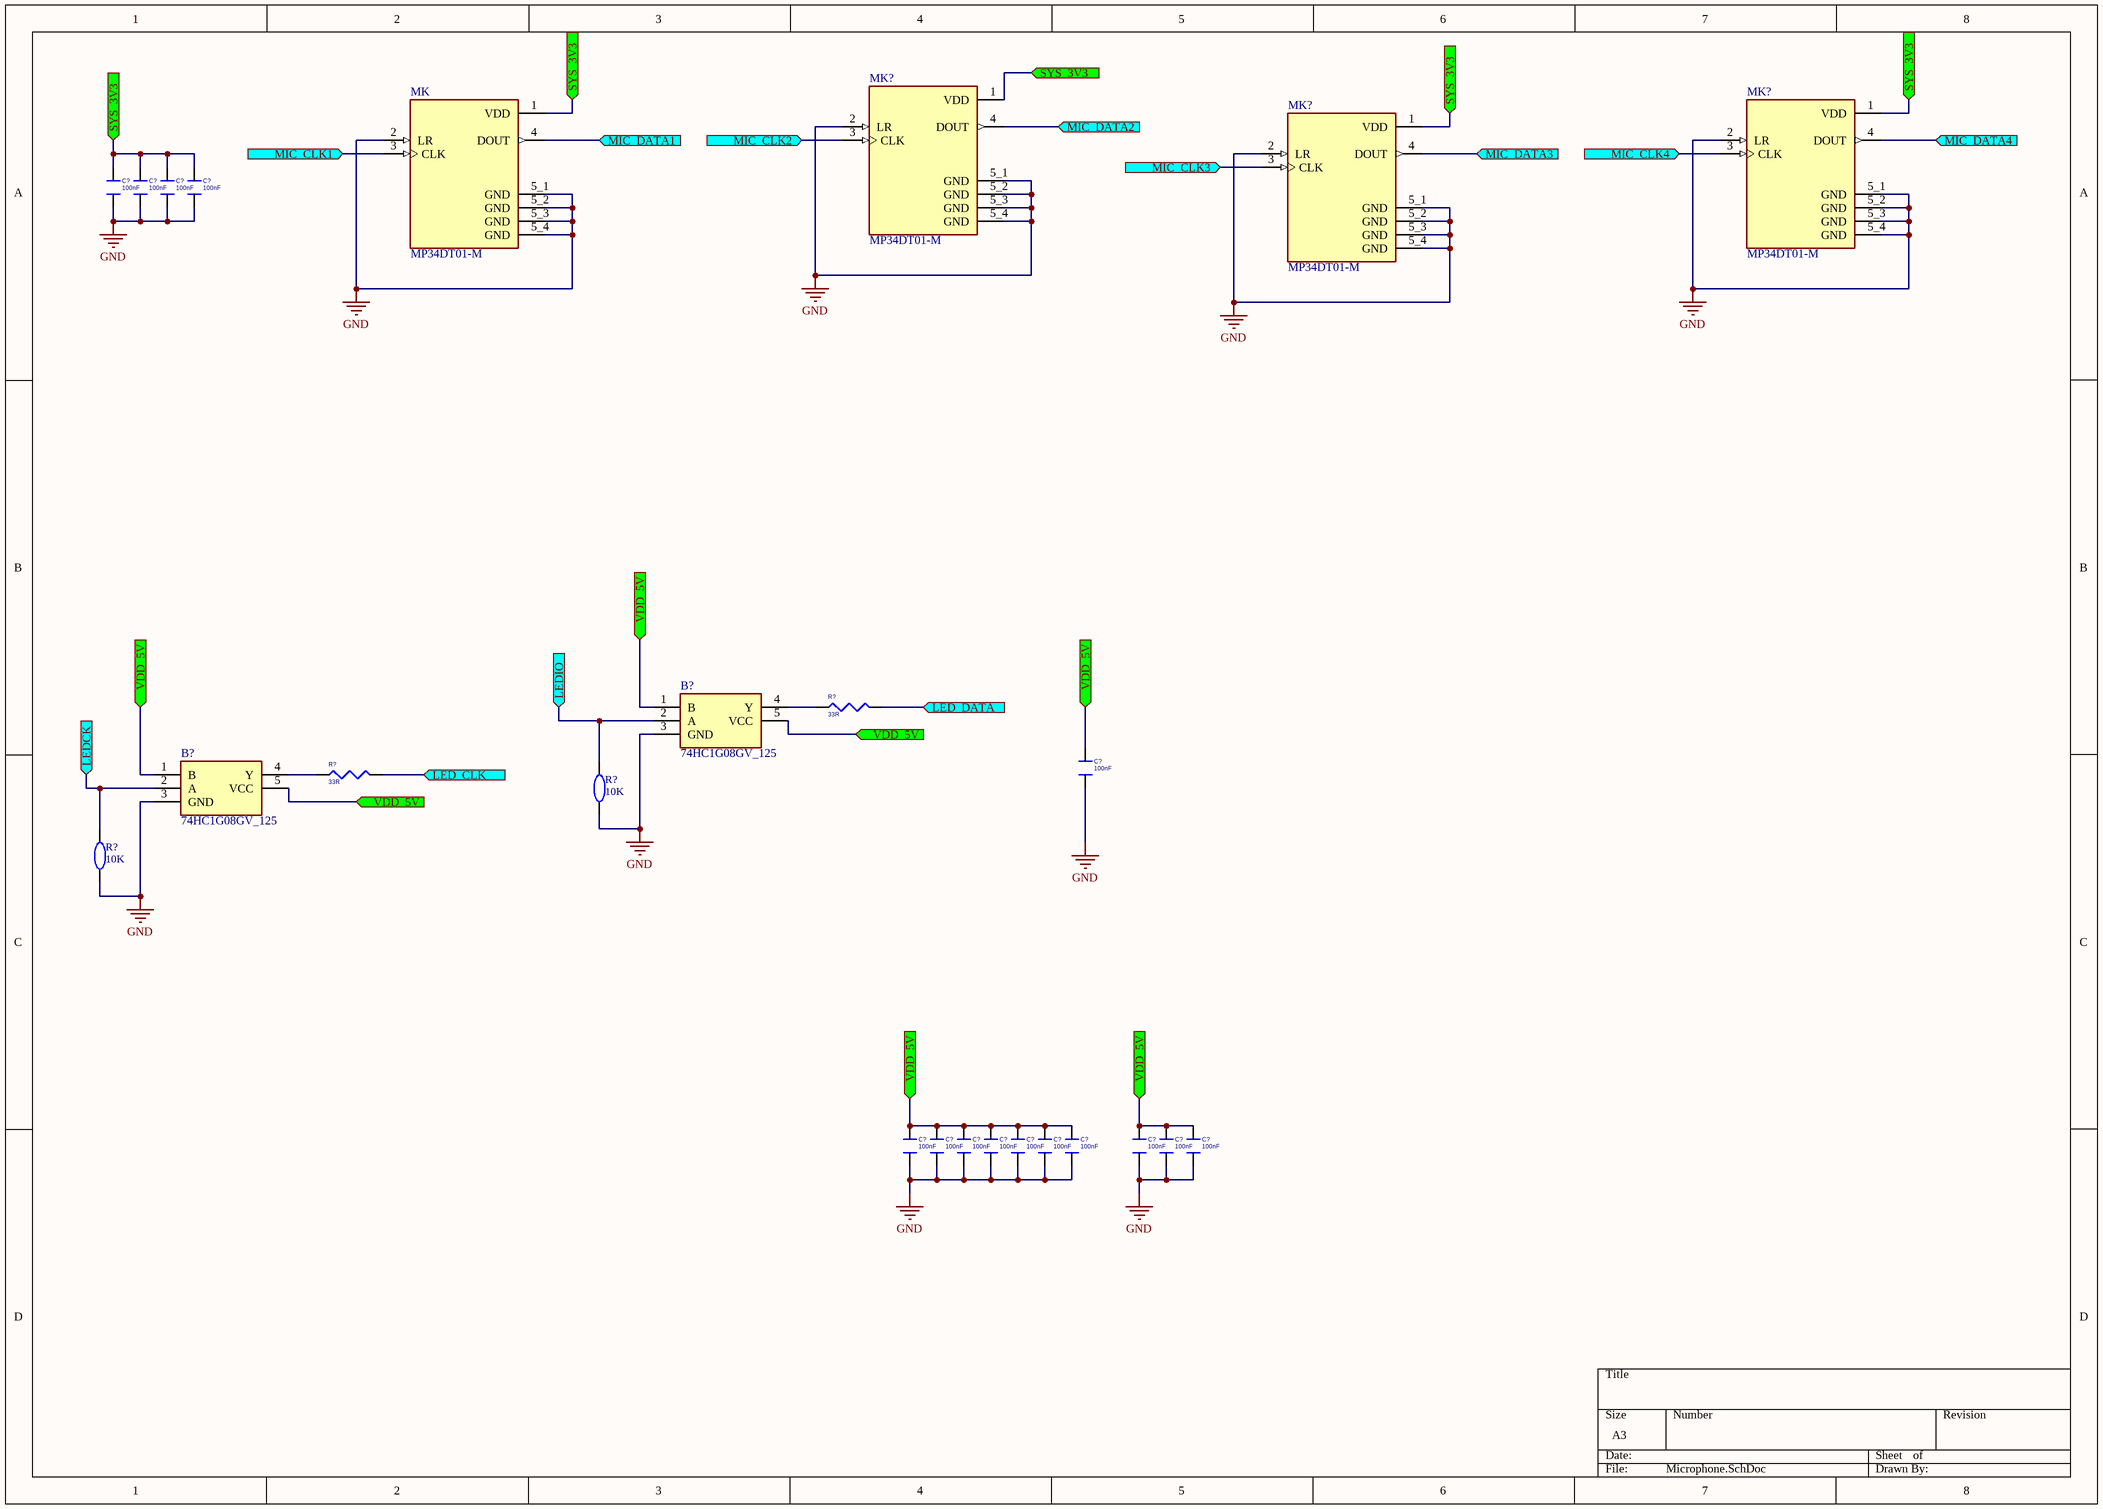
[diagram p3: Microphone.SchDoc]

### Parts
(Parts that share a designator on the sheet are numbered #1, #2 ... from top to bottom, then left to right.)
B?#6  74HC1G08GV_125  [SOT65P212X110-5N]
B?#7  74HC1G08GV_125  [SOT65P212X110-5N]
C?#41  100nF  [C0603]
C?#42  100nF  [C0603]
C?#43  100nF  [C0603]
C?#44  100nF  [C0603]
C?#45  100nF  [C0603]
C?#46  100nF  [C0603]
C?#47  100nF  [C0603]
C?#48  100nF  [C0603]
C?#49  100nF  [C0603]
C?#50  100nF  [C0603]
C?#51  100nF  [C0603]
C?#52  100nF  [C0603]
C?#53  100nF  [C0603]
C?#54  100nF  [C0603]
C?#55  100nF  [C0603]
MK  MP34DT01-M  [MIC_MP34DT01-M]
MK?#1  MP34DT01-M  [MIC_MP34DT01-M]
MK?#2  MP34DT01-M  [MIC_MP34DT01-M]
MK?#3  MP34DT01-M  [MIC_MP34DT01-M]
R?#36  33R  [R 0603]
R?#37  33R  [R 0603]
R?#38  Comment_1: 10K  [R 0603]  (hidden comment: 1K)
R?#39  Comment_1: 10K  [R 0603]  (hidden comment: 1K)

### Ports
LED_CLK (in), LED_DATA (in), LEDCK (in), LEDIO (in), MIC_CLK1 (in), MIC_CLK2 (in), MIC_CLK3 (in), MIC_CLK4 (in), MIC_DATA1 (in), MIC_DATA2 (in), MIC_DATA3 (in), MIC_DATA4 (in), SYS_3V3 (in), VDD_5V (in)

### Nets
GND: B?#6.3(GND) B?#7.3(GND) C?#41.1 C?#42.1 C?#43.1 C?#44.1 C?#45.1 C?#46.1 C?#47.1 C?#48.1 C?#49.1 C?#50.1 C?#51.1 C?#52.1 C?#53.1 C?#54.1 C?#55.1 MK.2(LR) MK.5_1(GND) MK.5_2(GND) MK.5_3(GND) MK.5_4(GND) MK?#1.2(LR) MK?#1.5_1(GND) MK?#1.5_2(GND) MK?#1.5_3(GND) MK?#1.5_4(GND) MK?#2.2(LR) MK?#2.5_1(GND) MK?#2.5_2(GND) MK?#2.5_3(GND) MK?#2.5_4(GND) MK?#3.2(LR) MK?#3.5_1(GND) MK?#3.5_2(GND) MK?#3.5_3(GND) MK?#3.5_4(GND) R?#38.1 R?#39.1
NetB?#1_6: C?#41.2 C?#42.2 C?#43.2 C?#44.2 MK.1(VDD) MK?#1.1(VDD) MK?#2.1(VDD) MK?#3.1(VDD) ; port SYS_3V3
NetB?#1_45: B?#6.1(B) B?#6.5(VCC) B?#7.1(B) B?#7.5(VCC) C?#45.2 C?#46.2 C?#47.2 C?#48.2 C?#49.2 C?#50.2 C?#51.2 C?#52.2 C?#53.2 C?#54.2 C?#55.2 ; port VDD_5V
NetB?#6_2: B?#6.2(A) R?#38.2 ; port LEDIO
NetB?#6_4: B?#6.4(Y) R?#36.1
NetB?#7_2: B?#7.2(A) R?#39.2 ; port LEDCK
NetB?#7_4: B?#7.4(Y) R?#37.1
NetC?#57_2: MK?#3.3(CLK) ; port MIC_CLK3
NetC?#61_2: MK?#1.3(CLK) ; port MIC_CLK2
NetC?#62_2: MK.3(CLK) ; port MIC_CLK1
NetC?#63_2: MK?#2.3(CLK) ; port MIC_CLK4
NetMK?#1_4: MK?#1.4(DOUT) ; port MIC_DATA2
NetMK?#2_4: MK?#2.4(DOUT) ; port MIC_DATA4
NetMK?#3_4: MK?#3.4(DOUT) ; port MIC_DATA3
NetMK_4: MK.4(DOUT) ; port MIC_DATA1
NetR?#36_2: R?#36.2 ; port LED_DATA
NetR?#37_2: R?#37.2 ; port LED_CLK

### Library data of the parts
B?#6 B?#7 = 74HC1G08GV_125: 74HC(T)1G08 - 2-input AND gate@en-us; Manufacturer_Name: Nexperia; Manufacturer_Part_Number: 74HC1G08GV,125; Geometry.Height: 1.1mm; Mouser Part Number: 771-74HC1G08GV; Mouser Price/Stock: https://www.mouser.co.uk/ProductDetail/Nexperia/74HC1G08GV125?qs=P62ublwmbi9shys2yLaZlQ%3D%3D; Arrow Part Number: 74HC1G08GV,125; Arrow Price/Stock: https://www.arrow.com/en/products/74hc1g08gv125/nexperia?region=nac; Datasheet Link: https://assets.nexperia.com/documents/data-sheet/74HC_HCT1G08.pdf
C?#41-C?#55 = CAPACITOR_0_Dup3: CAP ±20%/10V/X5R/SMT0603; PAGE: 1
MK MK?#1-MK?#3 = MP34DT01-M: MP34DT01-M MEMS Omnidirectional Microphones Audio Evaluation Board; MF: STMicroelectronics; Availability: Unavailable; Package: None; SnapEDA_Link: https://www.snapeda.com/parts/MP34DT01-M/STMicroelectronics/view-part/590970/?ref=snap; Price: None; MP: MP34DT01-M; Value: *
R?#36 R?#37 = R_Dup1: RES 1/16W 5% SMT0402
R?#38 R?#39 = 1.5K: Published: 8-Jun-2000; LatestRevisionDate: 17-Jul-2002; LatestRevisionNote: Re-released for DXP Platform.; PackageReference: AXIAL-0.4; Publisher: Altium Limited

## Sheet led.SchDoc
size A4; SheetNumber: 5; SheetTotal: 7
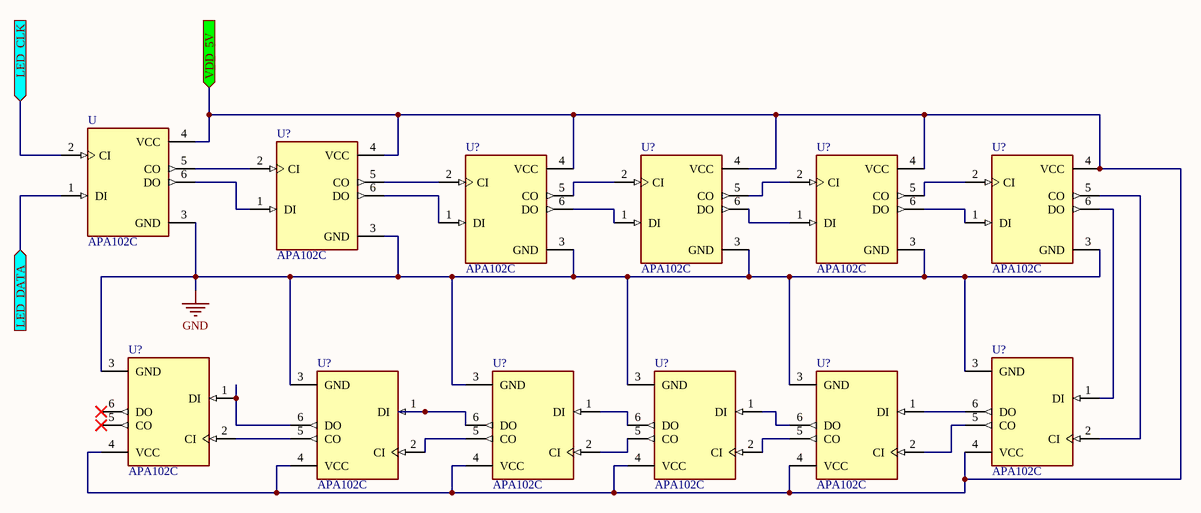
[diagram p4: led.SchDoc]

### Parts
(Parts that share a designator on the sheet are numbered #1, #2 ... from top to bottom, then left to right.)
U  APA102C  [SON160P500X500X140-6N]
U?#4  APA102C  [SON160P500X500X140-6N]
U?#5  APA102C  [SON160P500X500X140-6N]
U?#6  APA102C  [SON160P500X500X140-6N]
U?#7  APA102C  [SON160P500X500X140-6N]
U?#8  APA102C  [SON160P500X500X140-6N]
U?#9  APA102C  [SON160P500X500X140-6N]
U?#10  APA102C  [SON160P500X500X140-6N]
U?#11  APA102C  [SON160P500X500X140-6N]
U?#12  APA102C  [SON160P500X500X140-6N]
U?#13  APA102C  [SON160P500X500X140-6N]
U?#14  APA102C  [SON160P500X500X140-6N]

### Ports
LED_CLK (in), LED_DATA (in), VDD_5V (in)

### Nets
GND: U.3(GND) U?#4.3(GND) U?#5.3(GND) U?#6.3(GND) U?#7.3(GND) U?#8.3(GND) U?#9.3(GND) U?#10.3(GND) U?#11.3(GND) U?#12.3(GND) U?#13.3(GND) U?#14.3(GND)
NetB?#1_45: U.4(VCC) U?#4.4(VCC) U?#5.4(VCC) U?#6.4(VCC) U?#7.4(VCC) U?#8.4(VCC) U?#9.4(VCC) U?#10.4(VCC) U?#11.4(VCC) U?#12.4(VCC) U?#13.4(VCC) U?#14.4(VCC) ; port VDD_5V
NetR?#36_2: U.1(DI) ; port LED_DATA
NetR?#37_2: U.2(CI) ; port LED_CLK
NetU?#4_5: U?#4.5(CO) U?#5.2(CI)
NetU?#4_6: U?#4.6(DO) U?#5.1(DI)
NetU?#5_5: U?#5.5(CO) U?#6.2(CI)
NetU?#5_6: U?#5.6(DO) U?#6.1(DI)
NetU?#6_5: U?#6.5(CO) U?#7.2(CI)
NetU?#6_6: U?#6.6(DO) U?#7.1(DI)
NetU?#7_5: U?#7.5(CO) U?#8.2(CI)
NetU?#7_6: U?#7.6(DO) U?#8.1(DI)
NetU?#8_5: U?#8.5(CO) U?#10.2(CI)
NetU?#8_6: U?#8.6(DO) U?#10.1(DI)
NetU?#9_1: U?#9.1(DI) U?#11.6(DO)
NetU?#9_2: U?#9.2(CI) U?#11.5(CO)
NetU?#10_5: U?#10.5(CO) U?#14.2(CI)
NetU?#10_6: U?#10.6(DO) U?#14.1(DI)
NetU?#11_1: U?#11.1(DI) U?#12.6(DO)
NetU?#11_2: U?#11.2(CI) U?#12.5(CO)
NetU?#12_1: U?#12.1(DI) U?#13.6(DO)
NetU?#12_2: U?#12.2(CI) U?#13.5(CO)
NetU?#13_1: U?#13.1(DI) U?#14.6(DO)
NetU?#13_2: U?#13.2(CI) U?#14.5(CO)
NetU_5: U.5(CO) U?#4.2(CI)
NetU_6: U.6(DO) U?#4.1(DI)

Not connected (* = marked no-connect by the designer): U?#9 5(CO)* 6(DO)*

### Library data of the parts
U U?#4-U?#14 = APA102C: Addressable Lighting - 1 LED Discrete Serial Red, Green, Blue _RGB_ 5.00mm L x 5.00mm W; MF: Shiji Lighting; Package: SMD-6 Shiji Lightning; Value: *; Availability: Unavailable; SnapEDA_Link: https://www.snapeda.com/parts/APA102C/Shiji%20Lighting/view-part/231897/?ref=snap; Price: None; MP: APA102C

## Sheet Sys_Clock.SchDoc
size A4; SheetNumber: 6; SheetTotal: 6
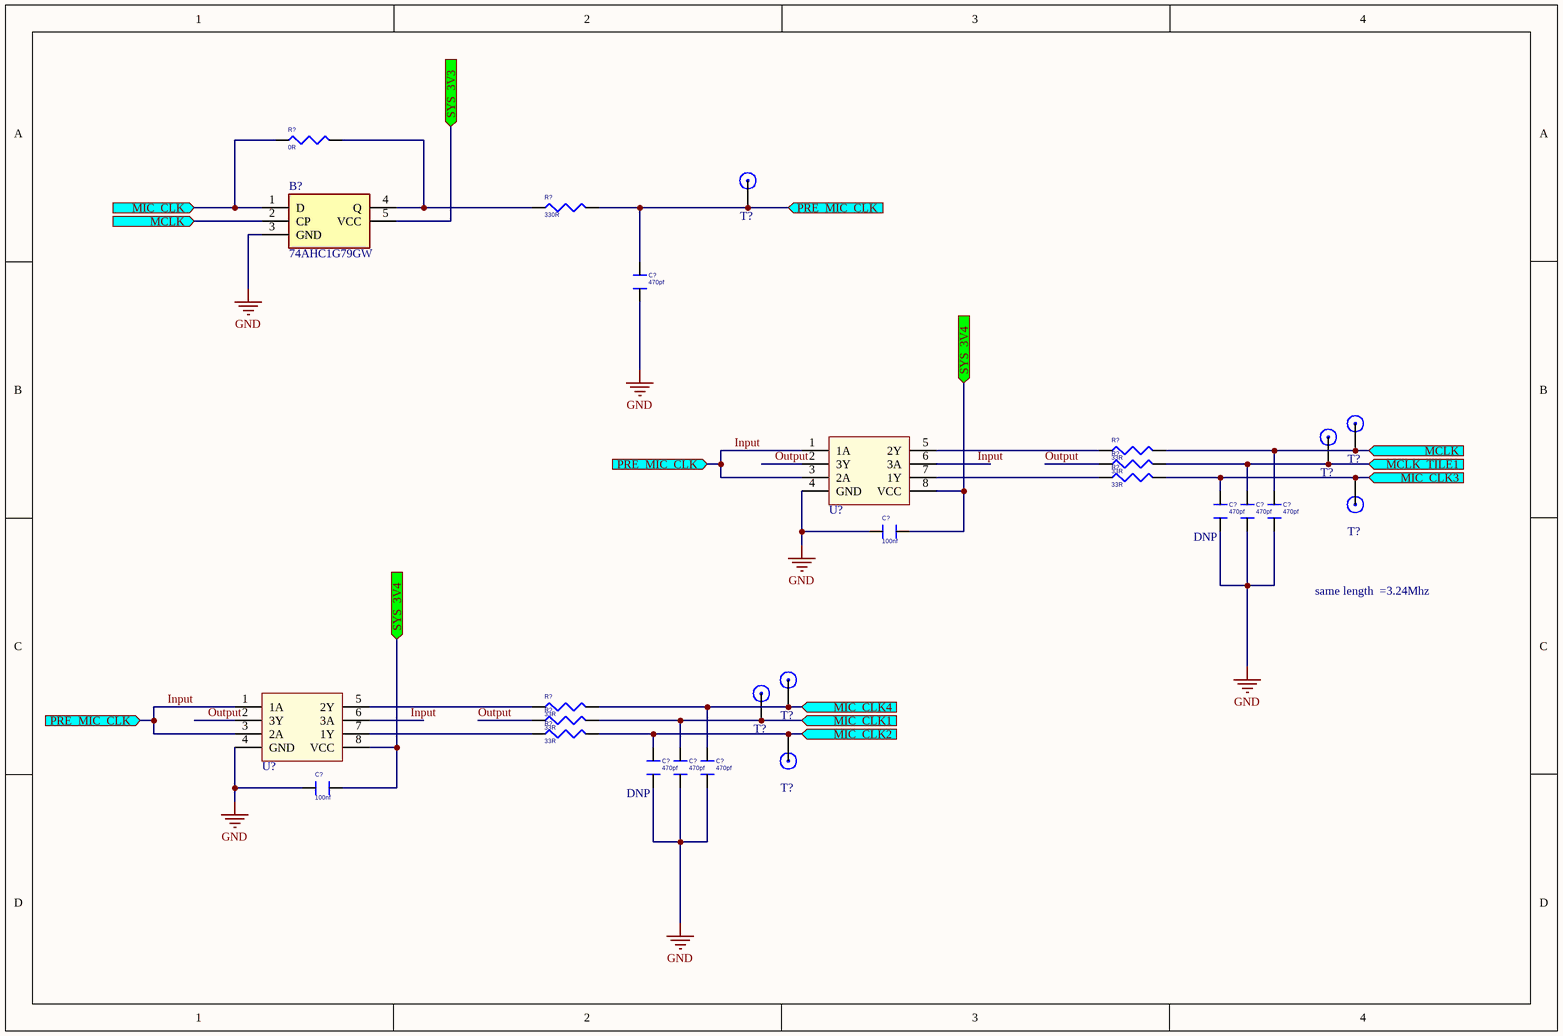
[diagram p5: Sys_Clock.SchDoc]

### Parts
(Parts that share a designator on the sheet are numbered #1, #2 ... from top to bottom, then left to right.)
B?#8  74AHC1G79GW  [SOT65P212X110-5N]
C?#56  470pf  [C0402]
C?#57  470pf  [C0402]
C?#58  470pf  [C0402]
C?#59  470pf  [C0402]
C?#60  100nf  [C0402]
C?#61  470pf  [C0402]
C?#62  470pf  [C0402]
C?#63  470pf  [C0402]
C?#64  100nf  [C0402]
R?#40  0R  [R 0603]
R?#41  330R  [R 0603]
R?#42  33R  [R 0603]
R?#43  33R  [R 0603]
R?#44  33R  [R 0603]
R?#45  33R  [R 0603]
R?#46  33R  [R 0603]
R?#47  33R  [R 0603]
T?#19  Test_point  [Test_point]  (value not drawn)
T?#20  Test_point  [Test_point]  (value not drawn)
T?#21  Test_point  [Test_point]  (value not drawn)
T?#22  Test_point  [Test_point]  (value not drawn)
T?#23  Test_point  [Test_point]  (value not drawn)
T?#24  Test_point  [Test_point]  (value not drawn)
T?#25  Test_point  [Test_point]  (value not drawn)
U?#15  NC7NZ34  [NC7NZ34]  (value not drawn)
U?#16  NC7NZ34  [NC7NZ34]  (value not drawn)

### Ports
MCLK (in), MCLK_TILE1 (in), MIC_CLK1 (in), MIC_CLK2 (in), MIC_CLK3 (in), MIC_CLK4 (in), MIC_CLK (in), PRE_MIC_CLK (in), SYS_3V3 (in), SYS_3V4 (in)

### Nets
GND: B?#8.3(GND) C?#56.1 C?#57.1 C?#58.1 C?#59.1 C?#60.2 C?#61.1 C?#62.1 C?#63.1 C?#64.2 U?#15.4(GND) U?#16.4(GND)
Input: C?#56.2 R?#41.2 T?#19.1 U?#15.1(1A) U?#15.3(2A) U?#15.6(3A) U?#16.1(1A) U?#16.3(2A) U?#16.6(3A) ; port PRE_MIC_CLK
Output: R?#43.1 R?#46.1 U?#15.2(3Y) U?#16.2(3Y)
NetB?#1_6: B?#8.5(VCC) ; port SYS_3V3
NetB?#1_20: C?#58.2 R?#43.2 T?#21.1 ; port MCLK_TILE1
NetB?#1_63: B?#8.2(CP) C?#59.2 R?#42.2 T?#20.1 ; port MCLK
NetB?#8_1: B?#8.1(D) R?#40.1 ; port MIC_CLK
NetB?#8_4: B?#8.4(Q) R?#40.2 R?#41.1
NetC?#57_2: C?#57.2 R?#44.2 T?#22.1 ; port MIC_CLK3
NetC?#60_1: C?#60.1 C?#64.1 U?#15.8(VCC) U?#16.8(VCC) ; port SYS_3V4
NetC?#61_2: C?#61.2 R?#47.2 T?#25.1 ; port MIC_CLK2
NetC?#62_2: C?#62.2 R?#46.2 T?#24.1 ; port MIC_CLK1
NetC?#63_2: C?#63.2 R?#45.2 T?#23.1 ; port MIC_CLK4
NetR?#42_1: R?#42.1 U?#15.5(2Y)
NetR?#44_1: R?#44.1 U?#15.7(1Y)
NetR?#45_1: R?#45.1 U?#16.5(2Y)
NetR?#47_1: R?#47.1 U?#16.7(1Y)

### Notes on the sheet
- (near C?#57) DNP
- same length  =3.24Mhz
- (near C?#61) DNP

### Library data of the parts
B?#8 = 74AHC1G79GW: NXP 74AHC1G79GW, Flip Flop IC, Single Ended, 2  5.5 V, 5-Pin TSSOP; Manufacturer_Name: Nexperia; Geometry.Height: 1.1mm; Manufacturer_Part_Number: 74AHC1G79GW; Mouser Part Number: N/A; Mouser Price/Stock: https://www.mouser.com/Search/Refine.aspx?Keyword=N%2FA; Arrow Part Number: *; Arrow Price/Stock: *; Datasheet Link: https://datasheet.datasheetarchive.com/originals/distributors/Datasheets-301/11791.pdf
C?#56-C?#64 = CAP_0402: CAP ±20%/6.3V/X5R/SMT0402
R?#40-R?#47 = R_0402: RES 1/16W 5% SMT0402
U?#15 U?#16 = NC7NZ34: On_Semiconductor

## Sheet X_core_Powerful_pull_up.SchDoc
size A4; SheetNumber: 7; SheetTotal: 7
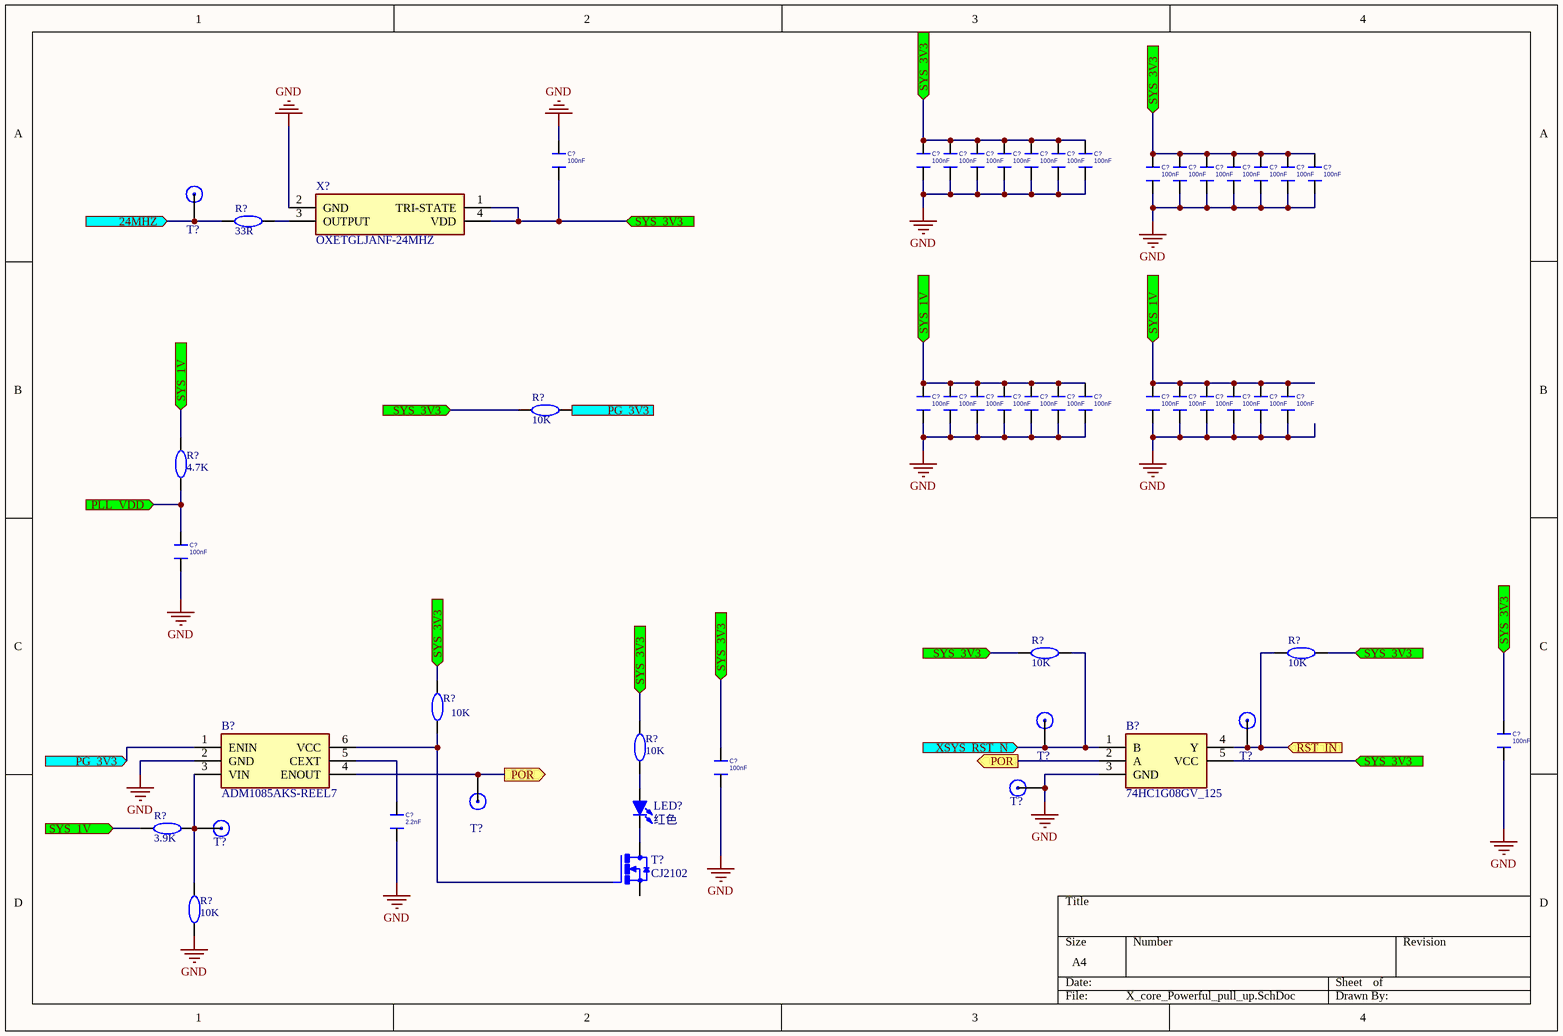
[diagram p6: X_core_Powerful_pull_up.SchDoc]

### Parts
(Parts that share a designator on the sheet are numbered #1, #2 ... from top to bottom, then left to right.)
B?#9  ADM1085AKS-REEL7  [SOT65P210X110-6N]
B?#10  74HC1G08GV_125  [SOT65P212X110-5N]
C?#65  100nF  [C0603]
C?#66  100nF  [C0603]
C?#67  100nF  [C0603]
C?#68  100nF  [C0603]
C?#69  100nF  [C0603]
C?#70  100nF  [C0603]
C?#71  100nF  [C0603]
C?#72  100nF  [C0603]
C?#73  100nF  [C0603]
C?#74  100nF  [C0603]
C?#75  100nF  [C0603]
C?#76  100nF  [C0603]
C?#77  100nF  [C0603]
C?#78  100nF  [C0603]
C?#79  100nF  [C0603]
C?#80  100nF  [C0603]
C?#81  100nF  [C0603]
C?#82  100nF  [C0603]
C?#83  100nF  [C0603]
C?#84  100nF  [C0603]
C?#85  100nF  [C0603]
C?#86  100nF  [C0603]
C?#87  100nF  [C0603]
C?#88  100nF  [C0603]
C?#89  100nF  [C0603]
C?#90  100nF  [C0603]
C?#91  100nF  [C0603]
C?#92  100nF  [C0603]
C?#93  100nF  [C0603]
C?#94  100nF  [C0603]
C?#95  100nF  [C0603]
C?#96  2.2nF  [C0603]
LED?  红色  [LED 0805G]
R?#48  Comment_1: 33R  [R 0603]  (hidden comment: 1A保险丝)
R?#49  1A保险丝  [R 0603]  (value not drawn)
R?#50  Comment_1: 4.7K  [R 0603]  (hidden comment: 1A保险丝)
R?#51  1A保险丝  [R 0603]  (value not drawn)
R?#52  1A保险丝  [R 0603]  (value not drawn)
R?#53  1A保险丝  [R 0603]  (value not drawn)
R?#54  1A保险丝  [R 0603]  (value not drawn)
R?#55  Comment_1: 3.9K  [R 0603]  (hidden comment: 1A保险丝)
R?#56  1A保险丝  [R 0603]  (value not drawn)
T?#26  Test_point  [Test_point]  (value not drawn)
T?#27  Test_point  [Test_point]  (value not drawn)
T?#28  Test_point  [Test_point]  (value not drawn)
T?#29  Test_point  [Test_point]  (value not drawn)
T?#30  Test_point  [Test_point]  (value not drawn)
T?#31  Test_point  [Test_point]  (value not drawn)
T?#32  CJ2102  [SOT23]
X?#2  OXETGLJANF-24MHZ  [OXETGLJANF24MHZ]

### Ports
24MHZ (in), PG_3V3 (in), PLL_VDD (in), POR (out), RST_IN (in), SYS_1V (in), SYS_3V3 (in), XSYS_RST_N (in)

### Nets
GND: B?#9.2(GND) B?#10.3(GND) C?#65.2 C?#66.1 C?#67.1 C?#68.1 C?#69.1 C?#70.1 C?#71.1 C?#72.1 C?#73.1 C?#74.1 C?#75.1 C?#76.1 C?#77.1 C?#78.1 C?#79.1 C?#80.1 C?#81.1 C?#82.1 C?#83.1 C?#84.1 C?#85.1 C?#86.1 C?#87.1 C?#88.1 C?#89.1 C?#90.1 C?#91.1 C?#92.1 C?#93.1 C?#94.1 C?#95.1 C?#96.1 R?#56.2 T?#29.1 X?#2.2(GND)
NetB?#1_6: B?#10.5(VCC) C?#65.1 C?#66.2 C?#67.2 C?#68.2 C?#69.2 C?#70.2 C?#71.2 C?#72.2 C?#73.2 C?#74.2 C?#75.2 C?#76.2 C?#77.2 C?#78.2 C?#79.2 C?#94.2 C?#95.2 R?#49.2 R?#51.1 R?#52.1 R?#53.1 R?#54.1 X?#2.1(TRI-STATE) X?#2.4(VDD) ; port SYS_3V3
NetB?#1_11: C?#80.2 C?#81.2 C?#82.2 C?#83.2 C?#84.2 C?#85.2 C?#86.2 C?#87.2 C?#88.2 C?#89.2 C?#90.2 C?#91.2 C?#92.2 R?#50.2 R?#55.2 ; port SYS_1V
NetB?#1_103: C?#93.2 R?#50.1 ; port PLL_VDD
NetB?#1_123: B?#10.4(Y) R?#52.2 T?#28.1 ; port RST_IN
NetB?#1_125: R?#48.1 T?#26.1 ; port 24MHZ
NetB?#9_1: B?#9.1(ENIN) R?#49.1 ; port PG_3V3
NetB?#9_3: B?#9.3(VIN) R?#55.1 R?#56.1 T?#31.1
NetB?#9_4: B?#9.4(ENOUT) B?#10.2(A) T?#30.1 ; port POR
NetB?#9_5: B?#9.5(CEXT) C?#96.2
NetB?#9_6: B?#9.6(VCC) R?#53.2 T?#32.1(G)
NetB?#10_1: B?#10.1(B) R?#51.2 T?#27.1 ; port XSYS_RST_N
NetLED?_1: LED?.1 R?#54.2
NetLED?_2: LED?.2 T?#32.3(D)
NetR?#48_2: R?#48.2 X?#2.3(OUTPUT)

Not connected (* = marked no-connect by the designer): T?#32 2(S)

### Library data of the parts
B?#9 = ADM1085AKS-REEL7: IC SIMPLE SEQUENCER OD SC70-6; Manufacturer_Name: Analog Devices; Geometry.Height: 1.1mm; Manufacturer_Part_Number: ADM1085AKS-REEL7; Mouser Part Number: *; Mouser Price/Stock: *; Arrow Part Number: *; Arrow Price/Stock: *; Datasheet Link: http://www.analog.com/media/en/technical-documentation/data-sheets/ADM1085_1086_1087.pdf
B?#10 = 74HC1G08GV_125: as B?#6 on sheet Microphone; Mouser Part Number: 771-74HC1G08GV; Mouser Price/Stock: https://www.mouser.co.uk/ProductDetail/Nexperia/74HC1G08GV125?qs=P62ublwmbi9shys2yLaZlQ%3D%3D; Arrow Part Number: 74HC1G08GV,125; Arrow Price/Stock: https://www.arrow.com/en/products/74hc1g08gv125/nexperia?region=nac; Datasheet Link: https://assets.nexperia.com/documents/data-sheet/74HC_HCT1G08.pdf
C?#65-C?#96 = CAPACITOR_0_Dup3: CAP ±20%/10V/X5R/SMT0603; PAGE: 1
LED? = LED-SMD: 贴片LED; 版权归属: 源创客; BOM名称: 贴片LED; 学习资源: www.ooocke.com
R?#48-R?#56 = 10K: Published: 8-Jun-2000; LatestRevisionDate: 17-Jul-2002; LatestRevisionNote: Re-released for DXP Platform.; PackageReference: AXIAL-0.4; Publisher: Altium Limited
  R?#49 R?#51-R?#54 R?#56: Comment_1: 10K
T?#32 = CJ2102: N-Channel 20V  2.1ASOT-323; MP: MMBF170; MF: ON Semiconductor; Availability: Unavailable; Package: SOT-23 ON Semiconductor; SnapEDA_Link: https://www.snapeda.com/parts/MMBF170/ON%20Semiconductor/view-part/1400962/?ref=snap; Price: None; Value: *
X?#2 = OXETGLJANF-24MHZ: as X?#1 on sheet WM8960; Manufacturer_Part_Number: OXETGLJANF-24MHZ; Mouser Part Number: *; Mouser Price/Stock: *; Arrow Part Number: *; Arrow Price/Stock: *; Datasheet Link: https://datasheet.lcsc.com/lcsc/1811052217_TAITIEN-Elec-OXETGLJANF-24MHZ_C295524.pdf

## Nets that join several sheets
GND: XVF3000 (10 pins), WM8960 (37 pins), Power_interconnect (19 pins), Microphone (39 pins), led (12 pins), Sys_Clock (12 pins), X_core_Powerful_pull_up (37 pins)
NetB?#1_1: XVF3000 (B?#1.1), Power_interconnect (T?#10.1)
NetB?#1_2: XVF3000 (B?#1.2), Power_interconnect (T?#12.1)
NetB?#1_6: XVF3000 (16 pins), WM8960 (9 pins), Power_interconnect (6 pins), Microphone (8 pins), Sys_Clock (B?#8.5), X_core_Powerful_pull_up (25 pins)
NetB?#1_8: XVF3000 (B?#1.8), Power_interconnect (T?#17.1)
NetB?#1_9: XVF3000 (B?#1.9), Power_interconnect (T?#15.1)
NetB?#1_11: XVF3000 (16 pins), Power_interconnect (6 pins), X_core_Powerful_pull_up (15 pins)
NetB?#1_20: XVF3000 (B?#1.20), Sys_Clock (C?#58.2 R?#43.2 T?#21.1)
NetB?#1_32: XVF3000 (B?#1.32), Power_interconnect (J?#1.3)
NetB?#1_45: XVF3000 (B?#1.45), WM8960 (8 pins), Power_interconnect (16 pins), Microphone (15 pins), led (12 pins)
NetB?#1_63: XVF3000 (B?#1.63), Sys_Clock (B?#8.2 C?#59.2 R?#42.2 T?#20.1)
NetB?#1_103: XVF3000 (B?#1.103), X_core_Powerful_pull_up (C?#93.2 R?#50.1)
NetB?#1_112: XVF3000 (B?#1.112 R?#2.2), WM8960 (B?#3.17 R?#24.2)
NetB?#1_113: XVF3000 (B?#1.113 R?#3.2), WM8960 (B?#3.18 R?#23.2)
NetB?#1_123: XVF3000 (B?#1.123 B?#1.124 C?#1.1), X_core_Powerful_pull_up (B?#10.4 R?#52.2 T?#28.1)
NetB?#1_125: XVF3000 (B?#1.125), X_core_Powerful_pull_up (R?#48.1 T?#26.1)
NetB?#1_127: XVF3000 (B?#1.127), Power_interconnect (T?#14.1)
NetB?#1_128: XVF3000 (B?#1.128), Power_interconnect (T?#16.1)
NetB?#3_12: XVF3000 (C?#4.2 R?#5.2), WM8960 (B?#3.12)
NetB?#3_13: XVF3000 (C?#3.2 R?#6.2), WM8960 (B?#3.13)
NetB?#3_14: XVF3000 (C?#2.2 R?#7.2), WM8960 (B?#3.14)
NetB?#6_2: XVF3000 (C?#6.2 R?#9.2), Microphone (B?#6.2 R?#38.2)
NetB?#7_2: XVF3000 (C?#5.2 R?#11.2), Microphone (B?#7.2 R?#39.2)
NetB?#8_1: XVF3000 (C?#7.2 R?#13.1), Sys_Clock (B?#8.1 R?#40.1)
NetC?#57_2: Microphone (MK?#3.3), Sys_Clock (C?#57.2 R?#44.2 T?#22.1)
NetC?#61_2: Microphone (MK?#1.3), Sys_Clock (C?#61.2 R?#47.2 T?#25.1)
NetC?#62_2: Microphone (MK.3), Sys_Clock (C?#62.2 R?#46.2 T?#24.1)
NetC?#63_2: Microphone (MK?#2.3), Sys_Clock (C?#63.2 R?#45.2 T?#23.1)
NetJ?#1_1: WM8960 (R?#20.1 U?#1.6), Power_interconnect (J?#1.1)
NetJ?#2_15: XVF3000 (R?#15.1), Power_interconnect (J?#2.15)
NetJ?#2_16: XVF3000 (R?#16.1), Power_interconnect (J?#2.16)
NetMK?#1_4: XVF3000 (R?#19.1), Microphone (MK?#1.4)
NetMK?#2_4: XVF3000 (R?#10.2), Microphone (MK?#2.4)
NetMK?#3_4: XVF3000 (R?#12.2), Microphone (MK?#3.4)
NetMK_4: XVF3000 (R?#18.1), Microphone (MK.4)
NetR?#1_2: XVF3000 (R?#1.2), Power_interconnect (T?#13.1)
NetR?#4_2: XVF3000 (R?#4.2), Power_interconnect (T?#11.1)
NetR?#36_2: Microphone (R?#36.2), led (U.1)
NetR?#37_2: Microphone (R?#37.2), led (U.2)